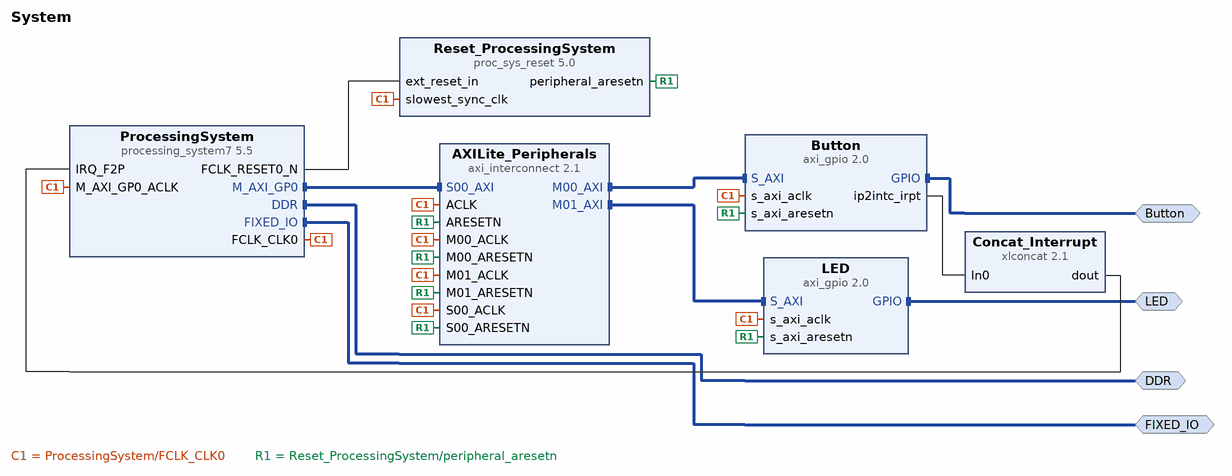
[diagram p0: block diagram of the top level]
# Vivado block design System, xc7z010clg400-1, Vivado 2019.2.1
create_bd_design System

create_bd_intf_port -mode Master -vlnv xilinx.com:interface:gpio_rtl:1.0 LED
create_bd_intf_port -mode Master -vlnv xilinx.com:interface:gpio_rtl:1.0 Button
create_bd_intf_port -mode Master -vlnv xilinx.com:interface:ddrx_rtl:1.0 DDR
create_bd_intf_port -mode Master -vlnv xilinx.com:display_processing_system7:fixedio_rtl:1.0 FIXED_IO

create_bd_cell -type ip -vlnv xilinx.com:ip:processing_system7:5.5 ProcessingSystem
set_property -dict [list \
  CONFIG.PCW_APU_PERIPHERAL_FREQMHZ 650.000000 \
  CONFIG.PCW_CRYSTAL_PERIPHERAL_FREQMHZ 50.000000 \
  CONFIG.PCW_ENET0_PERIPHERAL_ENABLE 0 \
  CONFIG.PCW_FCLK1_PERIPHERAL_CLKSRC {DDR PLL} \
  CONFIG.PCW_FCLK2_PERIPHERAL_CLKSRC {ARM PLL} \
  CONFIG.PCW_FPGA0_PERIPHERAL_FREQMHZ 100.000000 \
  CONFIG.PCW_FPGA1_PERIPHERAL_FREQMHZ 175.000000 \
  CONFIG.PCW_FPGA2_PERIPHERAL_FREQMHZ 12.288000 \
  CONFIG.PCW_FPGA3_PERIPHERAL_FREQMHZ 100.000000 \
  CONFIG.PCW_GPIO_MIO_GPIO_ENABLE 0 \
  CONFIG.PCW_GPIO_PERIPHERAL_ENABLE 1 \
  CONFIG.PCW_IMPORT_BOARD_PRESET D:/Downloads/Zybo.xml \
  CONFIG.PCW_IRQ_F2P_INTR 1 \
  CONFIG.PCW_PRESET_BANK1_VOLTAGE {LVCMOS 1.8V} \
  CONFIG.PCW_QSPI_PERIPHERAL_ENABLE 0 \
  CONFIG.PCW_SD0_PERIPHERAL_ENABLE 0 \
  CONFIG.PCW_UART1_PERIPHERAL_ENABLE 1 \
  CONFIG.PCW_UART1_UART1_IO {MIO 48 .. 49} \
  CONFIG.PCW_UART_PERIPHERAL_FREQMHZ 50 \
  CONFIG.PCW_UIPARAM_DDR_FREQ_MHZ 525.000000 \
  CONFIG.PCW_UIPARAM_DDR_PARTNO {MT41K128M16 JT-125} \
  CONFIG.PCW_USB0_PERIPHERAL_ENABLE 0 \
  CONFIG.PCW_USE_FABRIC_INTERRUPT 1 \
] [get_bd_cells ProcessingSystem]
# 271 more settings of ProcessingSystem are not shown: defaults, MIO pin electricals, DDR timing, and values the tool derives
create_bd_cell -type ip -vlnv xilinx.com:ip:axi_gpio:2.0 LED
set_property -dict {CONFIG.C_ALL_OUTPUTS 1 CONFIG.C_GPIO_WIDTH 4} [get_bd_cells LED]
create_bd_cell -type ip -vlnv xilinx.com:ip:axi_gpio:2.0 Button
set_property -dict {CONFIG.C_ALL_INPUTS 1 CONFIG.C_GPIO_WIDTH 4 CONFIG.C_INTERRUPT_PRESENT 1} [get_bd_cells Button]
create_bd_cell -type ip -vlnv xilinx.com:ip:axi_interconnect:2.1 AXILite_Peripherals
set_property -dict {CONFIG.NUM_MI 2} [get_bd_cells AXILite_Peripherals]
create_bd_cell -type ip -vlnv xilinx.com:ip:proc_sys_reset:5.0 Reset_ProcessingSystem
create_bd_cell -type ip -vlnv xilinx.com:ip:xlconcat:2.1 Concat_Interrupt
set_property -dict {CONFIG.NUM_PORTS 1} [get_bd_cells Concat_Interrupt]

# ---- connections ----

connect_bd_intf_net [get_bd_intf_pins AXILite_Peripherals/M01_AXI] [get_bd_intf_pins LED/S_AXI]
connect_bd_intf_net [get_bd_intf_ports Button] [get_bd_intf_pins Button/GPIO]
connect_bd_intf_net [get_bd_intf_ports DDR] [get_bd_intf_pins ProcessingSystem/DDR]
connect_bd_intf_net [get_bd_intf_ports FIXED_IO] [get_bd_intf_pins ProcessingSystem/FIXED_IO]
connect_bd_intf_net [get_bd_intf_pins AXILite_Peripherals/M00_AXI] [get_bd_intf_pins Button/S_AXI]
connect_bd_intf_net [get_bd_intf_pins ProcessingSystem/M_AXI_GP0] [get_bd_intf_pins AXILite_Peripherals/S00_AXI]
connect_bd_intf_net [get_bd_intf_ports LED] [get_bd_intf_pins LED/GPIO]
connect_bd_net [get_bd_pins ProcessingSystem/FCLK_CLK0] \
  [get_bd_pins ProcessingSystem/M_AXI_GP0_ACLK] [get_bd_pins AXILite_Peripherals/S00_ACLK] \
  [get_bd_pins Reset_ProcessingSystem/slowest_sync_clk] [get_bd_pins Button/s_axi_aclk] \
  [get_bd_pins AXILite_Peripherals/M00_ACLK] [get_bd_pins AXILite_Peripherals/ACLK] [get_bd_pins LED/s_axi_aclk] \
  [get_bd_pins AXILite_Peripherals/M01_ACLK]
connect_bd_net [get_bd_pins ProcessingSystem/FCLK_RESET0_N] [get_bd_pins Reset_ProcessingSystem/ext_reset_in]
connect_bd_net -net rst_ProcessingSystem_100M_peripheral_aresetn [get_bd_pins Reset_ProcessingSystem/peripheral_aresetn] \
  [get_bd_pins AXILite_Peripherals/S00_ARESETN] [get_bd_pins Button/s_axi_aresetn] \
  [get_bd_pins AXILite_Peripherals/M00_ARESETN] [get_bd_pins AXILite_Peripherals/ARESETN] [get_bd_pins LED/s_axi_aresetn] \
  [get_bd_pins AXILite_Peripherals/M01_ARESETN]
connect_bd_net -net xlconcat_0_dout [get_bd_pins Concat_Interrupt/dout] [get_bd_pins ProcessingSystem/IRQ_F2P]
connect_bd_net [get_bd_pins Button/ip2intc_irpt] [get_bd_pins Concat_Interrupt/In0]

# ---- address map ----
assign_bd_address -offset 0x41200000 -range 64K -target_address_space [get_bd_addr_spaces ProcessingSystem/Data] [get_bd_addr_segs Button/S_AXI/Reg]
assign_bd_address -offset 0x41210000 -range 64K -target_address_space [get_bd_addr_spaces ProcessingSystem/Data] [get_bd_addr_segs LED/S_AXI/Reg]

validate_bd_design
save_bd_design
